# EAGLE design Prototype (EAGLE 9.3.1)
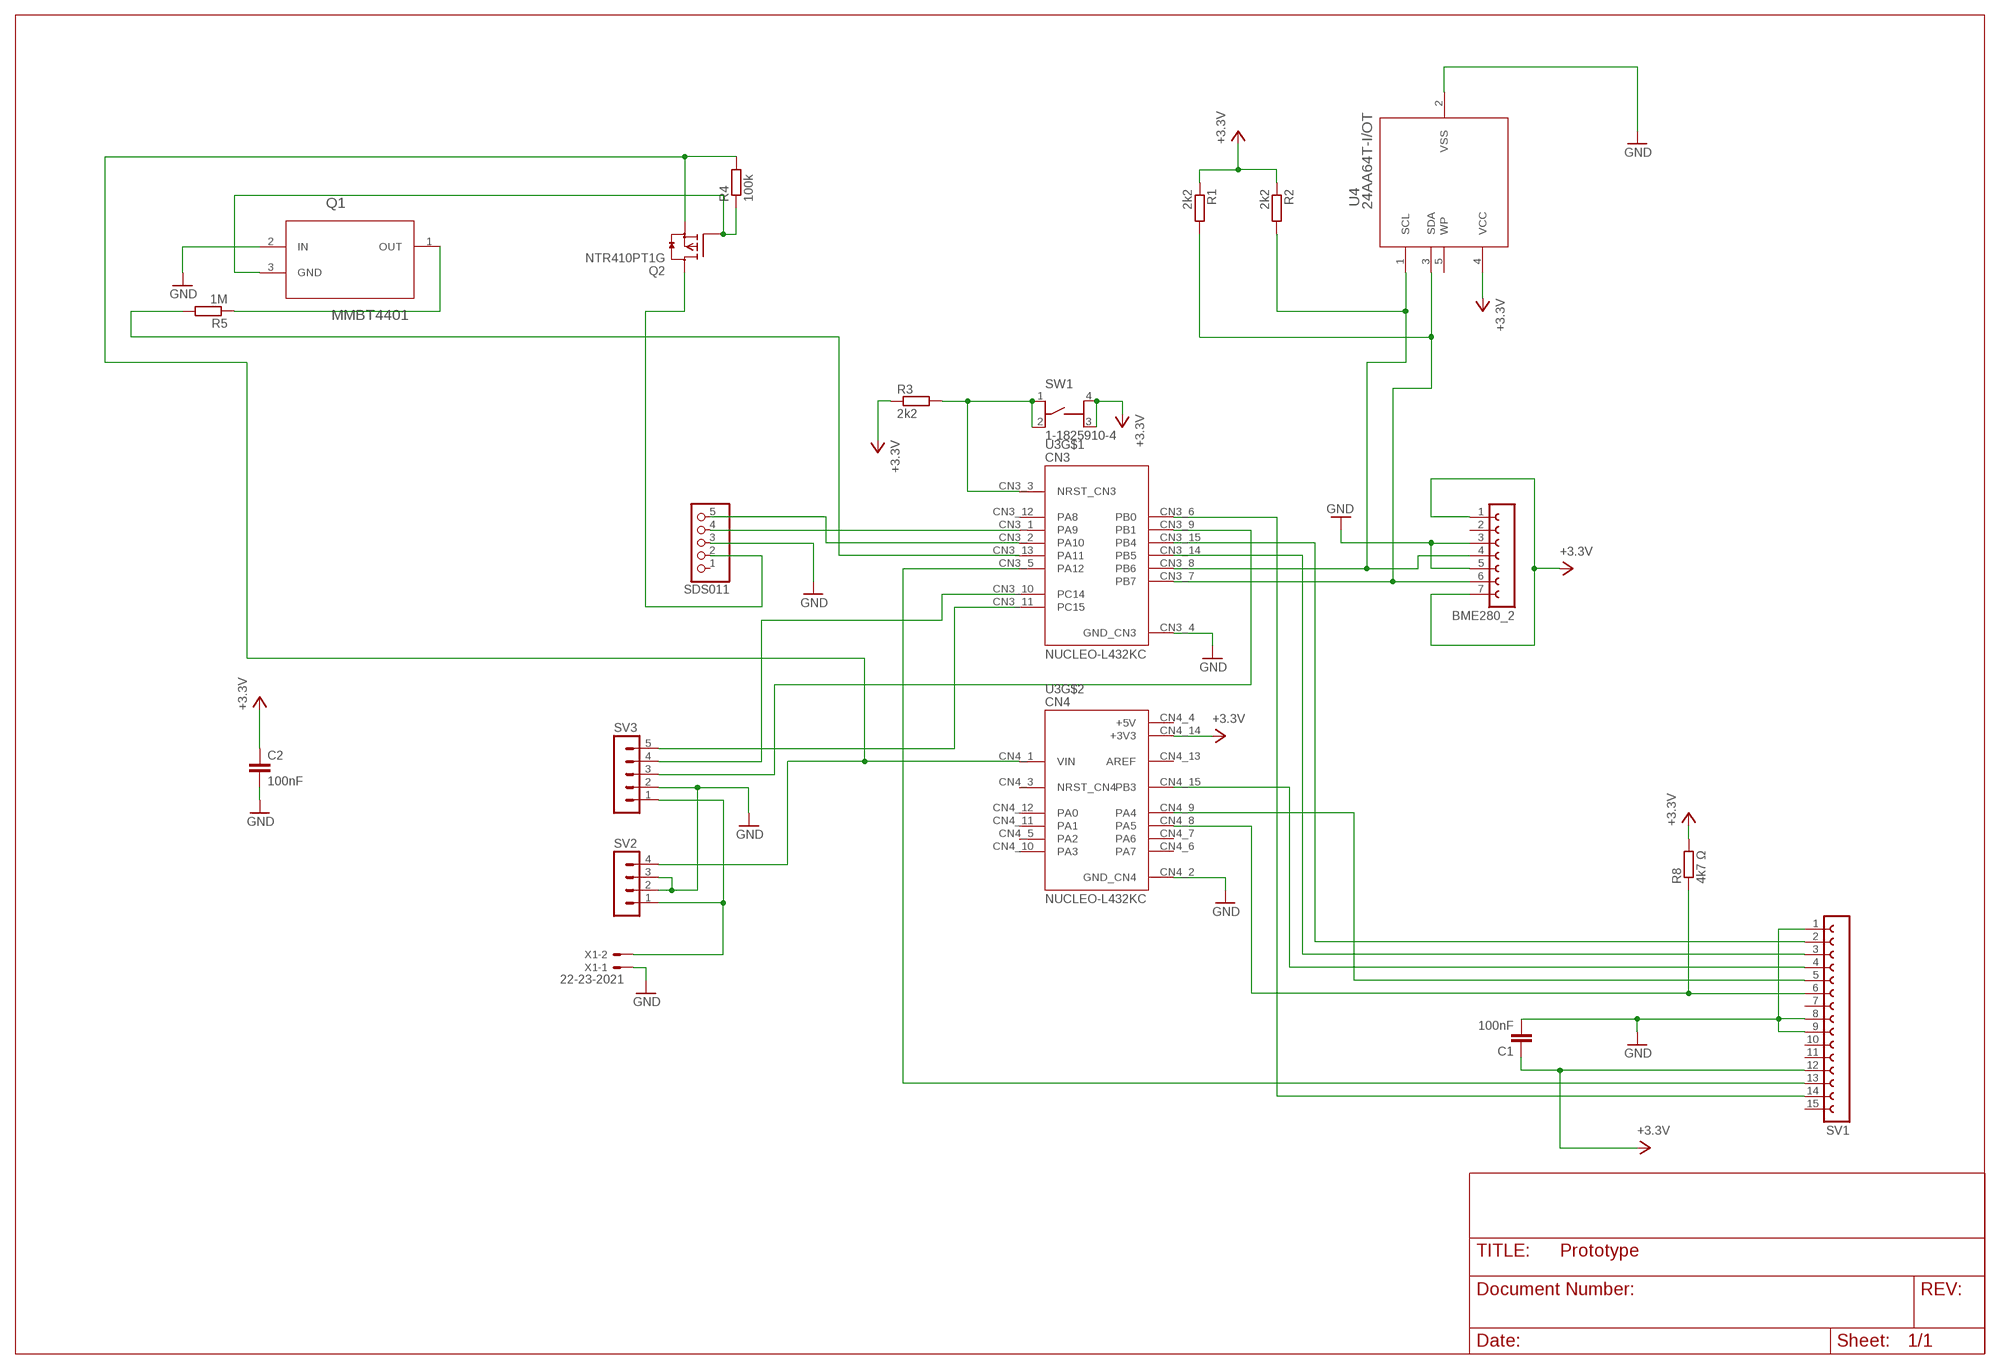
[diagram p0: schematic, sheet 1]

## Parts
BME280_2  FE07-1  [FE07]
C1  100nF  C-EUC0603K  [C0603K]
C2  100nF  C-EUC0603K  [C0603K]
Q1  MMBT4401  LM3480IM3-5.0  [SOT95P263X110-3N]
Q2  NTR410PT1G  BSS84LT1  [SOT23]
R1  2k2  R-EU_R1206W  [R1206W]
R2  2k2  R-EU_R1206W  [R1206W]
R3  2k2  R-EU_R1206W  [R1206W]
R4  100k  R-EU_R1206W  [R1206W]
R5  1M  R-EU_R1206W  [R1206W]
R8  4k7 Ω  R-EU_R1206W  [R1206W]
SDS011  PINHD-1X5  [1X05]
SV1  FE15-1  [FE15]
SV2  MA04-1  [MA04-1]
SV3  MA05-1  [MA05-1]
SW1  1-1825910-4  [TE_1-1825910-4]
U3  NUCLEO-L432KC  [MODULE_NUCLEO-L432KC]
U4  24AA64T-I/OT  [SOT-23-5_MC]
X1  22-23-2021  [22-23-2021]

## Nets
GND: BME280_2.3 BME280_2.5 C1.2 C2.2 Q1.2(IN) SDS011.3 SV1.1 SV1.8 SV1.9 SV2.2 SV2.3 SV3.2 U3.CN3_4(GND_CN3) U3.CN4_2(GND_CN4) U4.2(VSS) X1.1
N$1: SV1.5 U3.CN4_9(PA4)
N$2: SDS011.4 U3.CN3_1(PA9)
N$3: SV1.14 U3.CN3_6(PB0)
N$4: BME280_2.4 R2.2 U3.CN3_8(PB6) U4.1(SCL)
N$5: R3.2 SW1.1 SW1.2 U3.CN3_3(NRST_CN3)
N$6: SDS011.5 U3.CN3_2(PA10)
N$9: Q1.3(GND) Q2.1(G) R4.1
N$10: Q2.3(D) SDS011.2
N$14: SV1.13 U3.CN3_5(PA12)
N$15: R8.1 SV1.6 U3.CN4_8(PA5)
N$17: SV1.3 U3.CN3_14(PB5)
N$18: Q2.2(S) R4.2 SV2.4 U3.CN4_1(VIN)
N$19: SV1.2 U3.CN3_15(PB4)
N$20: SV1.4 U3.CN4_15(PB3)
N$21: Q1.1(OUT) R5.1
N$22: SV2.1 SV3.1 X1.2
N$23: BME280_2.6 R1.2 U3.CN3_7(PB7) U4.3(SDA)
N$24: SV3.3 U3.CN3_9(PB1)
N$25: SV3.4 U3.CN3_10(PC14)
N$26: SV3.5 U3.CN3_11(PC15)
N$29: R5.2 U3.CN3_13(PA11)
VCC: BME280_2.1 BME280_2.7 C1.1 C2.1 R1.1 R2.1 R3.1 R8.2 SV1.12 SW1.3 SW1.4 U3.CN4_14(+3V3) U4.4(VCC) ; supply symbol labelled +3.3V
Unconnected: BME280_2.2 SDS011.1 SV1.7 SV1.10 SV1.11 SV1.15 U3.CN3_12(PA8) U3.CN4_3(NRST_CN4) U3.CN4_5(PA2) U3.CN4_6(PA7) U3.CN4_7(PA6) U3.CN4_10(PA3) U3.CN4_11(PA1) U3.CN4_12(PA0) U3.CN4_13(AREF) U4.5(WP)

## Power pins joined to a net without a drawn wire
+5V: U3.CN4_4(+5V)

## Library data of the parts
BME280_2 = con-lsta:FE07-1: FEMALE HEADER; OC_FARNELL: unknown; OC_NEWARK: unknown
C1 C2 = rcl:C-EU: CAPACITOR, European symbol; SPICEPREFIX: C
Q1 = LM3480IM3-5.0:LM3480IM3-5.0: Linear Voltage Regulator; AVAILABILITY: Unavailable; DESCRIPTION: Linear Voltage Regulator IC 1 Output 100mA SOT-23-3; MF: Texas Instruments; MP: LM3480IM3-5.0; PACKAGE: SOT-23 Texas Instruments; PRICE: None
Q2 = BSS84LT1:BSS84LT1: OnSemi's BSS84LT1 Power MOSFET 130 mA, 50 V RDS(on) = 10 P-Channel SOT-23 Description: These miniature surface mount MOSFETs reduce power loss conserve energy, making this device ideal for use in small power management circuitry. Typical applications are DC/DC converters, load switching, power management in portable and battery-powered products such as computers, printers, cellular and cordless telephones. Features: Energy Efficient Miniature SOT-23 Surface Mount Package Saves Board Space Pb-Free Package is Available Please send any comments to: messi@users.sourceforge.net; AVAILABILITY: Unavailable; DESCRIPTION: P-Channel 50V 130mA _Ta_ Surface Mount SOT-23-3 _TO-236_; MF: ON Semiconductor; MP: BSS84LT1; PACKAGE: SOT-23 ON Semiconductor; PRICE: None
R1-R5 R8 = rcl:R-EU_: RESISTOR, European symbol; SPICEPREFIX: R
SDS011 = pinhead:PINHD-1X5: PIN HEADER
SV1 = con-lsta:FE15-1: FEMALE HEADER; OC_FARNELL: unknown; OC_NEWARK: unknown
SV2 = con-lstb:MA04-1: PIN HEADER; OC_FARNELL: unknown; OC_NEWARK: unknown
SV3 = con-lstb:MA05-1: PIN HEADER; OC_FARNELL: unknown; OC_NEWARK: unknown
SW1 = 1-1825910-4:1-1825910-4: Switch Tactile OFF (ON) SPST Round Button PC Pins 0.05A 24VDC 100000Cycles 1.56N Thru-Hole Loose; AVAILABILITY: Unavailable; DESCRIPTION: Tactile Switch SPST-NO Top Actuated Through Hole; MF: TE Connectivity; MP: 118259104; PACKAGE: None; PRICE: None; TE_PURCHASE_URL: https://www.te.com/usa-en/product-118259104.html?te_bu=Cor&te_type=disp&te_campaign=seda_glo_cor-seda-global-disp-prtnr-fy19-seda-model-bom-cta_sma-317_1&elqCampaignId=32493
U3 = NUCLEO-L432KC:NUCLEO-L432KC: STM32 Nucleo-32 development board with STM32L432KC MCU, supports Arduino connectivity; AVAILABILITY: Unavailable; DESCRIPTION: STM32L432KC, mbed-Enabled Development Nucleo-32 STM32L4 ARM® Cortex®-M4 MCU 32-Bit Embedded Evaluation Board; MF: STMicroelectronics; MP: NUCLEO-L432KC; PACKAGE: None; PRICE: None
U4 = 24AA64:24AA64T-I/OT; BUILT_BY: EMA_Jessica; COPYRIGHT: Copyright (C) 2018 Accelerated Designs. All rights reserved; MANUFACTURER_PART_NUMBER: 24AA64T-I/OT; VENDOR: Microchip
X1 = con-molex:22-23-2021: .100" (2.54mm) Center Header - 2 Pin; MF: MOLEX; MPN: 22-23-2021; OC_FARNELL: 1462926; OC_NEWARK: 25C3832

## Board
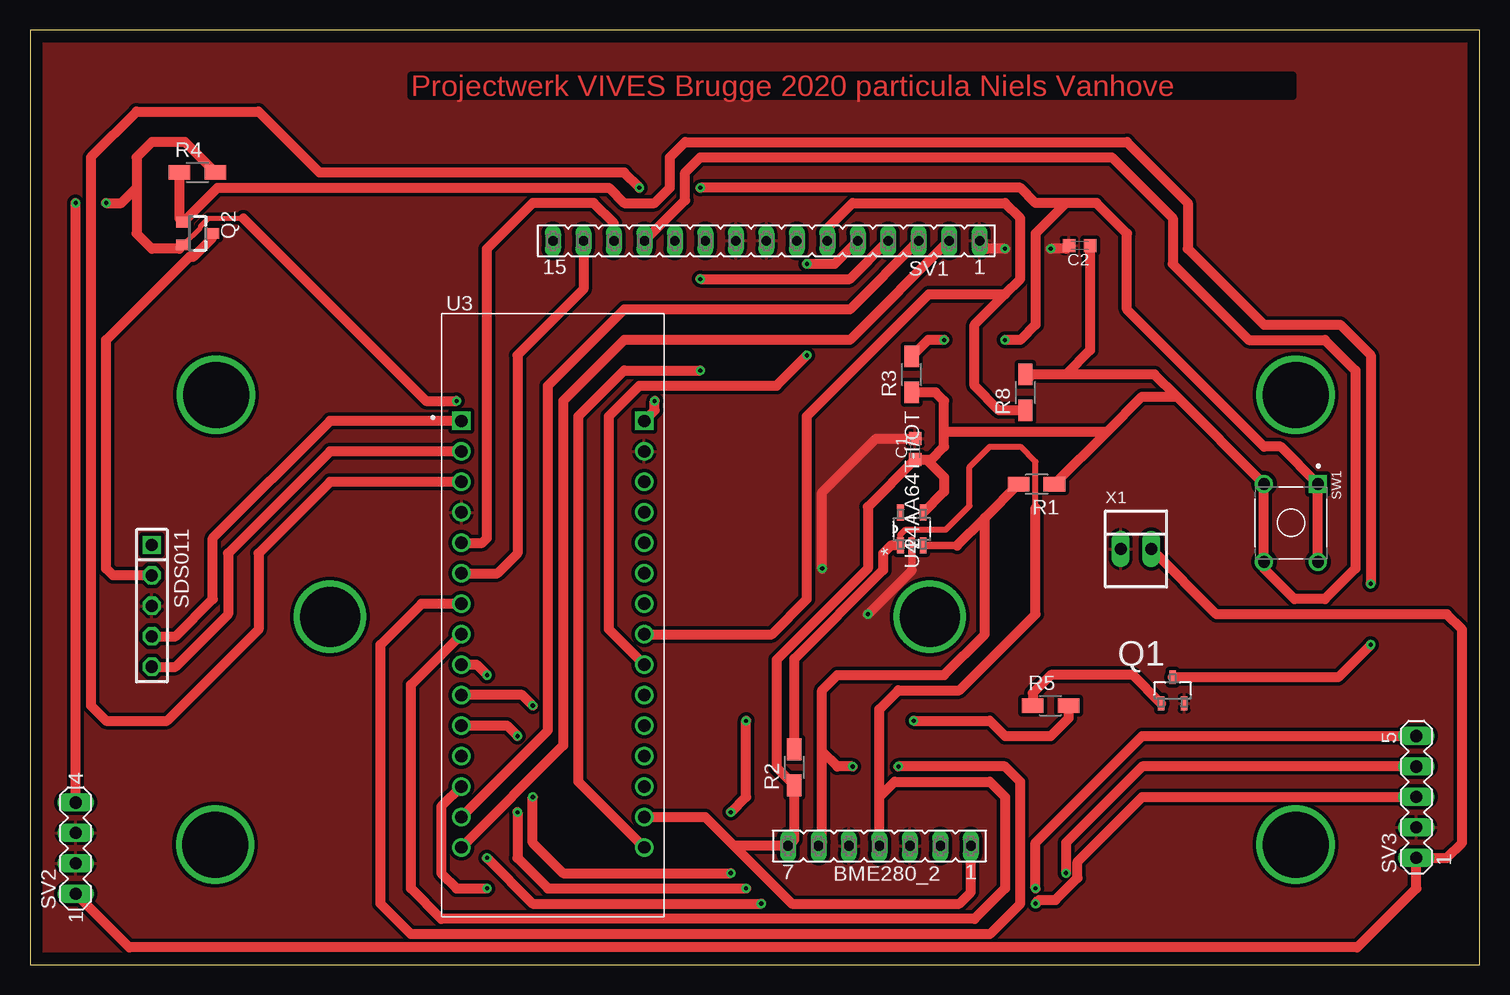
[diagram p1: board, top side]
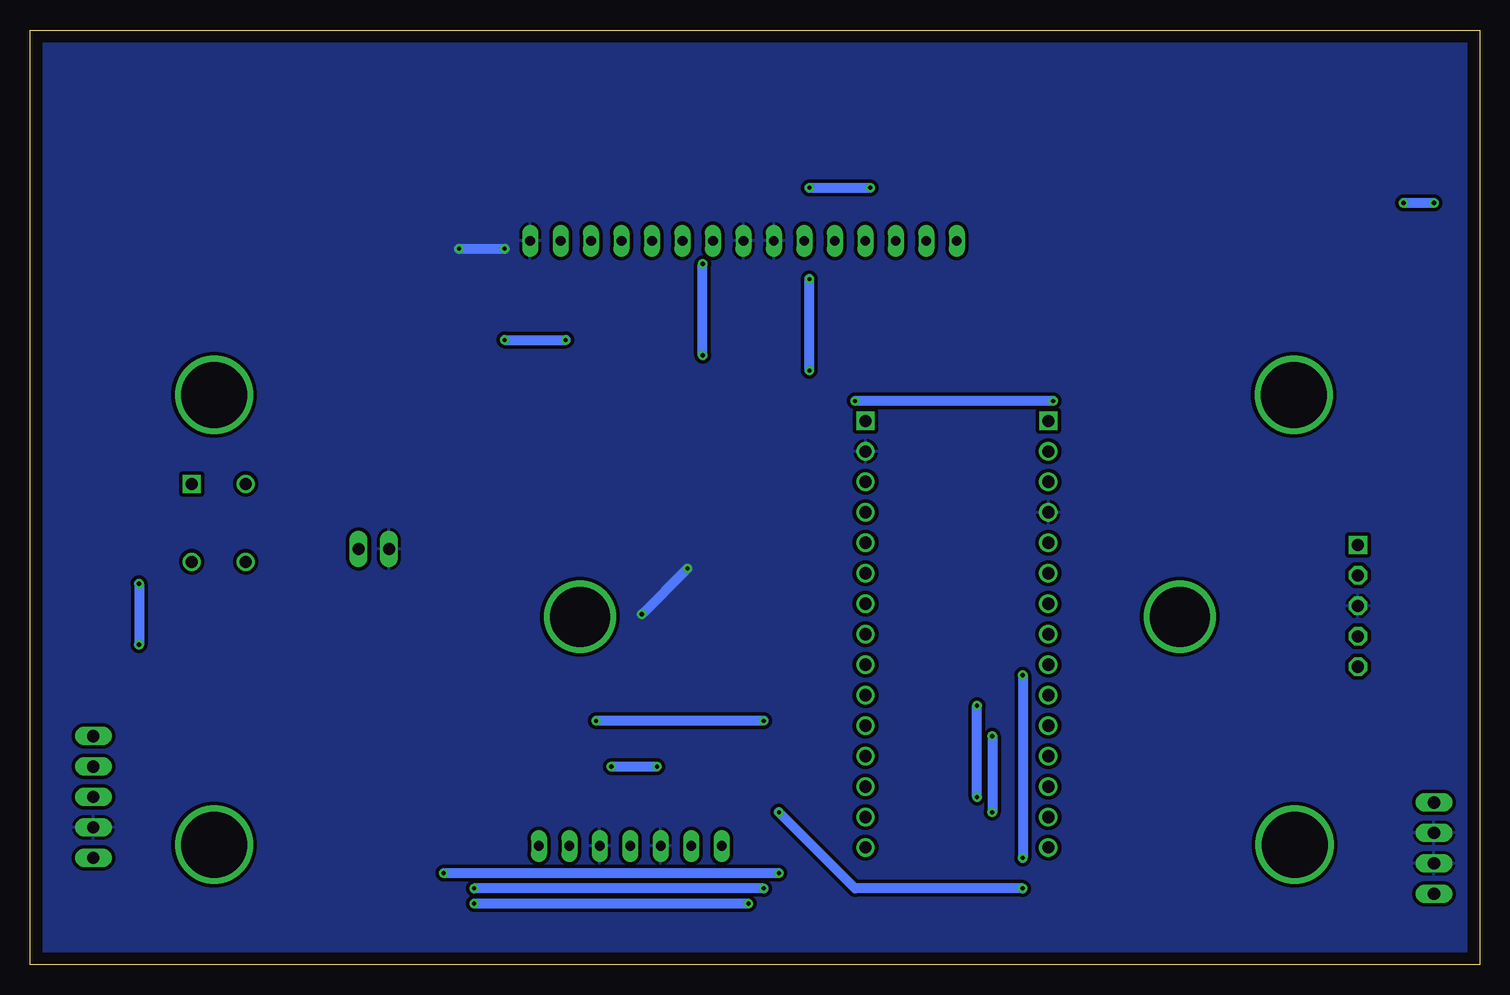
[diagram p2: board, bottom side, seen from below]

Size 120.85 x 77.92 mm. Coordinates in mm from the lower left corner, seen from the top.
Outline: 0,0 120.85,0 120.85,77.92 0,77.92 0,0
Copper layers (1*16): Top 0.035mm / dielectric 1.5mm / Bottom 0.035mm
Design rules "default": minimum track width 6mil, minimum drill 0.35mm, track to track 6mil, track to pad 6mil, pad to pad 6mil, via to via 6mil, smd to smd 6mil, copper to edge 40mil, drill to drill 6mil, minimum pad ring 10mil, minimum via ring 8mil, stop-mask expansion 4mil, vias tented up to drill 0mil, thermal gap 10mil

### Footprints (pad centres in the part's own frame; a part is rotated, then mirrored left to right if it is on the bottom)
FE07 = drill 0.813 long: 1 -7.62,0; 2 -5.08,0; 3 -2.54,0; 4 0,0; 5 2.54,0; 6 5.08,0; 7 7.62,0
C0603K = smd 1.05 x 1.08: 1 -0.875,0; 2 0.875,0
SOT95P263X110-3N = smd 0.559 x 1.143: 1 -0.965,-1.092; 2 0.965,-1.092; 3 0,1.092
SOT23 = smd 0.9 x 1.2: 1 -0.95,-1.2; 2 0.95,-1.2; 3 0,1.2
R1206W = smd 1.8 x 1.2: 1 -1.499,0; 2 1.499,0
1X05 = drill 1.016 square: 1 -5.08,0 | drill 1.016 octagon: 2 -2.54,0; 3 0,0; 4 2.54,0; 5 5.08,0
FE15 = drill 0.813 long: 1 -17.78,0; 2 -15.24,0; 3 -12.7,0; 4 -10.16,0; 5 -7.62,0; 6 -5.08,0; 7 -2.54,0; 8 0,0; 9 2.54,0; 10 5.08,0; 11 7.62,0; 12 10.16,0; 13 12.7,0; 14 15.24,0; 15 17.78,0
MA04-1 = drill 1.016 long: 1 -3.81,0; 2 -1.27,0; 3 1.27,0; 4 3.81,0
MA05-1 = drill 1.016 long: 1 -5.08,0; 2 -2.54,0; 3 0,0; 4 2.54,0; 5 5.08,0
TE_1-1825910-4 = drill 0.99 square: 1 -3.25,2.25 | drill 0.99: 2 3.25,2.25; 3 -3.25,-2.25; 4 3.25,-2.25
MODULE_NUCLEO-L432KC = drill 1.02 square: CN3_1 -7.62,16.215; CN4_1 7.62,16.215 | drill 1.02: CN3_2 -7.62,13.675; CN3_3 -7.62,11.135; CN3_4 -7.62,8.595; CN3_5 -7.62,6.055; CN3_6 -7.62,3.515; CN3_7 -7.62,0.975; CN3_8 -7.62,-1.565; CN3_9 -7.62,-4.105; CN3_10 -7.62,-6.645; CN3_11 -7.62,-9.185; CN3_12 -7.62,-11.725; CN3_13 -7.62,-14.265; CN3_14 -7.62,-16.805; CN3_15 -7.62,-19.345; CN4_2 7.62,13.675; CN4_3 7.62,11.135; CN4_4 7.62,8.595; CN4_5 7.62,6.055; CN4_6 7.62,3.515; CN4_7 7.62,0.975; CN4_8 7.62,-1.565; CN4_9 7.62,-4.105; CN4_10 7.62,-6.645; CN4_11 7.62,-9.185; CN4_12 7.62,-11.725; CN4_13 7.62,-14.265; CN4_14 7.62,-16.805; CN4_15 7.62,-19.345
SOT-23-5_MC = smd 1.321 x 0.559: 1 -1.372,0.95; 2 -1.372,0; 3 -1.372,-0.95; 4 1.372,-0.95; 5 1.372,0.95
22-23-2021 = drill 1 long: 1 -1.27,0; 2 1.27,0

### Placement (x,y rotation side)
BME280_2  70.81,9.89 180 top
C1  73.79,42.98 90 top
C2  87.49,59.95 180 top
Q1  95.25,22.86 0 top
Q2  13.97,60.96 270 top
R1  83.9,40.05 180 top
R2  63.72,16.44 90 top
R3  73.49,49.2 90 top
R4  13.97,66.04 0 top
R5  85.09,21.59 0 top
R8  82.98,47.71 90 top
SDS011  10.15,29.91 270 top
SV1  61.38,60.34 180 top
SV2  3.81,9.7 90 top
SV3  115.57,13.97 90 top
SW1  105.12,36.83 270 top
U3  43.58,29.11 0 top
U4  73.51,36.31 90 top
X1  92.19,34.65 0 top

### Tracks (layer width: path | path; a pad name or v marks a point on that pad's centre or on a via)
GND  (via drill 0.35)
  Top 0.61: 73.51,32.87 U4.2
  Top 0.813: C2.2 86.36,59.69 v85.09,59.69 | v81.28,59.69 79.81,59.69 SV1.1 | v69.85,29.21 73.51,32.87 | v66.04,33.02 66.04,39.37 70.53,43.85 C1.2
  Bottom 0.813: v85.09,59.69 v81.28,59.69 | v69.85,29.21 v66.04,33.02
  pour Top (isolate 0.305): 0.02,0.02 0.02,77.89 120.82,77.89 120.82,0.02
  pour Bottom (isolate 0.305): 0.02,0.02 0.02,77.89 120.82,77.89 120.82,0.02
N$1  (via drill 0.35)
  Top 0.813: U3.CN4_9 48.26,27.95 48.26,45.72 50.8,48.26 62.23,48.26 v64.77,50.8 | SV1.5 67.08,58.42 v64.77,58.42
  Bottom 0.813: v64.77,50.8 v64.77,58.42
N$2
  Top 0.813: U3.CN3_1 25,45.33 15.24,35.56 15.24,30.48 12.13,27.37 SDS011.4
N$3
  Top 0.813: U3.CN3_6 38.98,32.62 40.64,34.29 40.64,50.8 46.14,56.3 SV1.14
N$4
  Top 0.508: 83.82,38.1 83.82,41.91 82.55,43.18 80.01,43.18 78.33,41.5 78.33,38.25 76.35,36.27 72.98,36.27 72.56,35.85 U4.1
  Top 0.813: BME280_2.4 70.81,13.97 | R2.2 63.72,24.83 63.71,24.84 63.71,25.49 71.12,32.9 71.12,34.29 71.77,34.94 U4.1 | 70.81,13.97 72.08,15.24 80.01,15.24 81.28,13.97 81.28,6.35 78.74,3.81 34.29,3.81 31.75,6.35 31.75,23.34 U3.CN3_8 | 83.82,38.1 83.82,29.21 77.47,22.86 72.39,22.86 70.81,21.28 70.81,13.97
N$5  (via drill 0.35)
  Top 0.813: SW1.2 SW1.1 104.27,43.18 102.87,43.18 91.44,54.61 91.44,60.96 88.9,63.5 86.36,63.5 | 86.36,63.5 83.82,60.96 83.82,53.34 82.55,52.07 v81.28,52.07 | v76.2,52.07 74.86,52.07 R3.2 | 86.36,63.5 83.82,63.5 82.55,64.77 v55.88,64.77 | U3.CN3_3 25,40.24 19.05,34.29 19.05,27.94 11.43,20.32 6.35,20.32 5.08,21.59 5.08,67.31 8.89,71.12 19.05,71.12 24.13,66.04 49.53,66.04 v50.8,64.77
  Bottom 0.813: v81.28,52.07 v76.2,52.07 | v55.88,64.77 v50.8,64.77
N$6
  Top 0.813: SDS011.5 12.13,24.83 16.51,29.21 16.51,34.29 25,42.78 U3.CN3_2
N$7  (via drill 5)
  other vias: 25,29
N$8  (via drill 5)
  other vias: 75,29
N$9  (via drill 0.35)
  Top 0.813: R4.1 12.47,62.21 Q2.1 15.63,64.77 48.26,64.77 49.53,63.5 52.07,63.5 53.34,64.77 53.34,67.31 54.61,68.58 91.44,68.58 96.52,63.5 96.52,59.69 102.87,53.34 109.22,53.34 111.76,50.8 v111.76,31.75 | v111.76,26.67 109.04,23.95 Q1.3
  Bottom 0.813: v111.76,31.75 v111.76,26.67
N$10
  Top 0.813: Q2.3 15.17,60.57 13.6,59 13.28,59 6.35,52.07 6.35,33.02 6.92,32.45 SDS011.2
N$11  (via drill 5.5)
  other vias: 15.43,10
N$12  (via drill 5.5)
  other vias: 105.5,10
N$13  (via drill 5.5)
  other vias: 105.5,47.5
N$14
  Top 0.813: SV1.13 48.68,61.81 46.99,63.5 41.91,63.5 38.1,59.69 38.1,35.56 37.7,35.16 U3.CN3_5
N$15
  Top 0.813: 82.06,46.21 R8.1 80.79,46.21 78.74,48.26 78.74,53.34 81.28,55.88 | 81.28,55.88 82.55,57.15 82.55,62.23 81.28,63.5 68.58,63.5 66.46,61.38 SV1.6 | U3.CN4_8 61.84,27.55 64.77,30.48 64.77,45.72 74.93,55.88 81.28,55.88
N$16  (via drill 5.5)
  other vias: 15.5,47.5
N$17
  Top 0.813: U3.CN3_14 43.18,19.52 43.18,48.26 49.53,54.61 68.35,54.61 SV1.3
N$18  (via drill 0.35)
  Top 0.406: Q2.2 14.21,61.45 14.21,61.56 14.89,62.23 17.78,62.23
  Top 0.813: R4.2 12.93,68.58 10.16,68.58 8.89,67.31 8.89,64.77 | 8.89,64.77 8.89,60.96 10.16,59.69 12.45,59.69 Q2.2 | v6.35,63.5 7.62,63.5 8.89,64.77 | SV2.4 v3.81,63.5 | 17.78,62.23 33.02,46.99 v35.56,46.99 | U3.CN4_1 52.07,46.2 v52.07,46.99
  Bottom 0.813: v3.81,63.5 v6.35,63.5 | v35.56,46.99 v52.07,46.99
N$19
  Top 0.813: SV1.2 68.35,52.07 49.53,52.07 44.45,46.99 44.45,18.25 U3.CN3_15
N$20  (via drill 0.35)
  Top 0.813: U3.CN4_15 45.72,15.24 45.72,45.72 49.53,49.53 v55.88,49.53 | v55.88,57.15 68.35,57.15 SV1.4
  Bottom 0.813: v55.88,49.53 v55.88,57.15
N$21
  Top 0.813: Q1.1 91.92,24.13 85.09,24.13 83.59,22.63 R5.1
N$22
  Top 0.813: X1.2 98.9,29.21 118.11,29.21 119.38,27.94 119.38,10.16 118.11,8.89 SV3.1 115.57,6.35 110.64,1.42 8.28,1.42 SV2.1
N$23  (via drill 0.35)
  Top 0.61: U4.3 77.29,34.94
  Top 0.813: R1.2 79.6,37.24 | 77.29,34.94 79.6,37.24 | BME280_2.6 66.04,10.2 66.04,17.78 | U3.CN3_7 32.62,30.09 29.21,26.67 29.21,5.08 31.75,2.54 80.01,2.54 82.55,5.08 82.55,15.24 81.28,16.51 v72.39,16.51 | v68.58,16.51 67.31,16.51 66.04,17.78 | 66.04,17.78 66.04,22.86 67.31,24.13 76.2,24.13 79.6,27.53 79.6,37.24
  Bottom 0.813: v72.39,16.51 v68.58,16.51
N$24  (via drill 0.35)
  Top 0.813: U3.CN3_9 37.23,25 v38.1,24.13 | v38.1,8.89 41.91,5.08 v60.96,5.08 | SV3.3 92.71,13.97 87.33,8.59 87.33,7.22 85.49,5.38 84.12,5.38 v83.82,5.08
  Bottom 0.813: v60.96,5.08 v83.82,5.08 | v38.1,24.13 v38.1,8.89
N$25  (via drill 0.35)
  Top 0.813: SV3.4 92.71,16.51 86.36,10.16 v86.36,7.62 | v41.91,13.97 41.91,10.16 44.45,7.62 v58.42,7.62 | v41.91,21.59 41.03,22.46 U3.CN3_10
  Bottom 0.813: v41.91,13.97 v41.91,21.59 | v58.42,7.62 v86.36,7.62
N$26  (via drill 0.35)
  Top 0.813: U3.CN3_11 39.77,19.93 v40.64,19.05 | v40.64,12.7 40.64,8.89 43.18,6.35 v59.69,6.35 | v83.82,6.35 83.82,10.16 92.71,19.05 SV3.5
  Bottom 0.813: v40.64,19.05 v40.64,12.7 | v59.69,6.35 v83.82,6.35
N$29  (via drill 0.35)
  Top 0.813: U3.CN3_13 34.29,13.18 34.29,7.62 35.56,6.35 v38.1,6.35 | v58.42,12.7 59.69,13.97 v59.69,20.32 | v73.66,20.32 80.01,20.32 81.28,19.05 85.09,19.05 86.59,20.55 R5.2
  Bottom 0.813: v38.1,6.35 52.07,6.35 v58.42,12.7 | v59.69,20.32 v73.66,20.32
VCC
  Top 0.813: 95.61,47.34 SW1.3 SW1.4 102.87,33.02 105.41,30.48 107.95,30.48 110.49,33.02 110.49,49.53 107.95,52.07 101.6,52.07 95.25,58.42 95.25,62.23 90.17,67.31 55.88,67.31 54.61,66.04 54.61,63.73 SV1.12 | 95.61,47.34 93.74,49.21 86.36,49.21 | 86.36,49.21 R8.2 | C2.1 88.36,51.21 86.36,49.21 | R1.1 89.8,44.45 | 89.8,44.45 92.69,47.34 95.61,47.34 | U4.4 76.2,39.42 76.2,40.64 74.73,42.1 C1.1 | C1.1 75.12,42.1 76.2,43.18 76.2,44.45 | 76.2,44.45 76.2,46.99 75.49,47.7 R3.1 | 76.2,44.45 89.8,44.45 | U3.CN4_14 56.27,12.3 58.69,9.89 | 58.69,9.89 63.5,5.08 77.47,5.08 78.43,6.04 BME280_2.1 | C1.1 69.85,38.16 69.85,33.02 62.23,25.4 62.23,16.43 R2.1 63.72,10.42 BME280_2.7 58.69,9.89
  Top 1.016: R8.2 83.21,48.98

### Text on the board
Top: Projectwerk VIVES Brugge 2020 particula Niels Vanhove